# Altium schematic sheet fpga_core.SchDoc
size A4
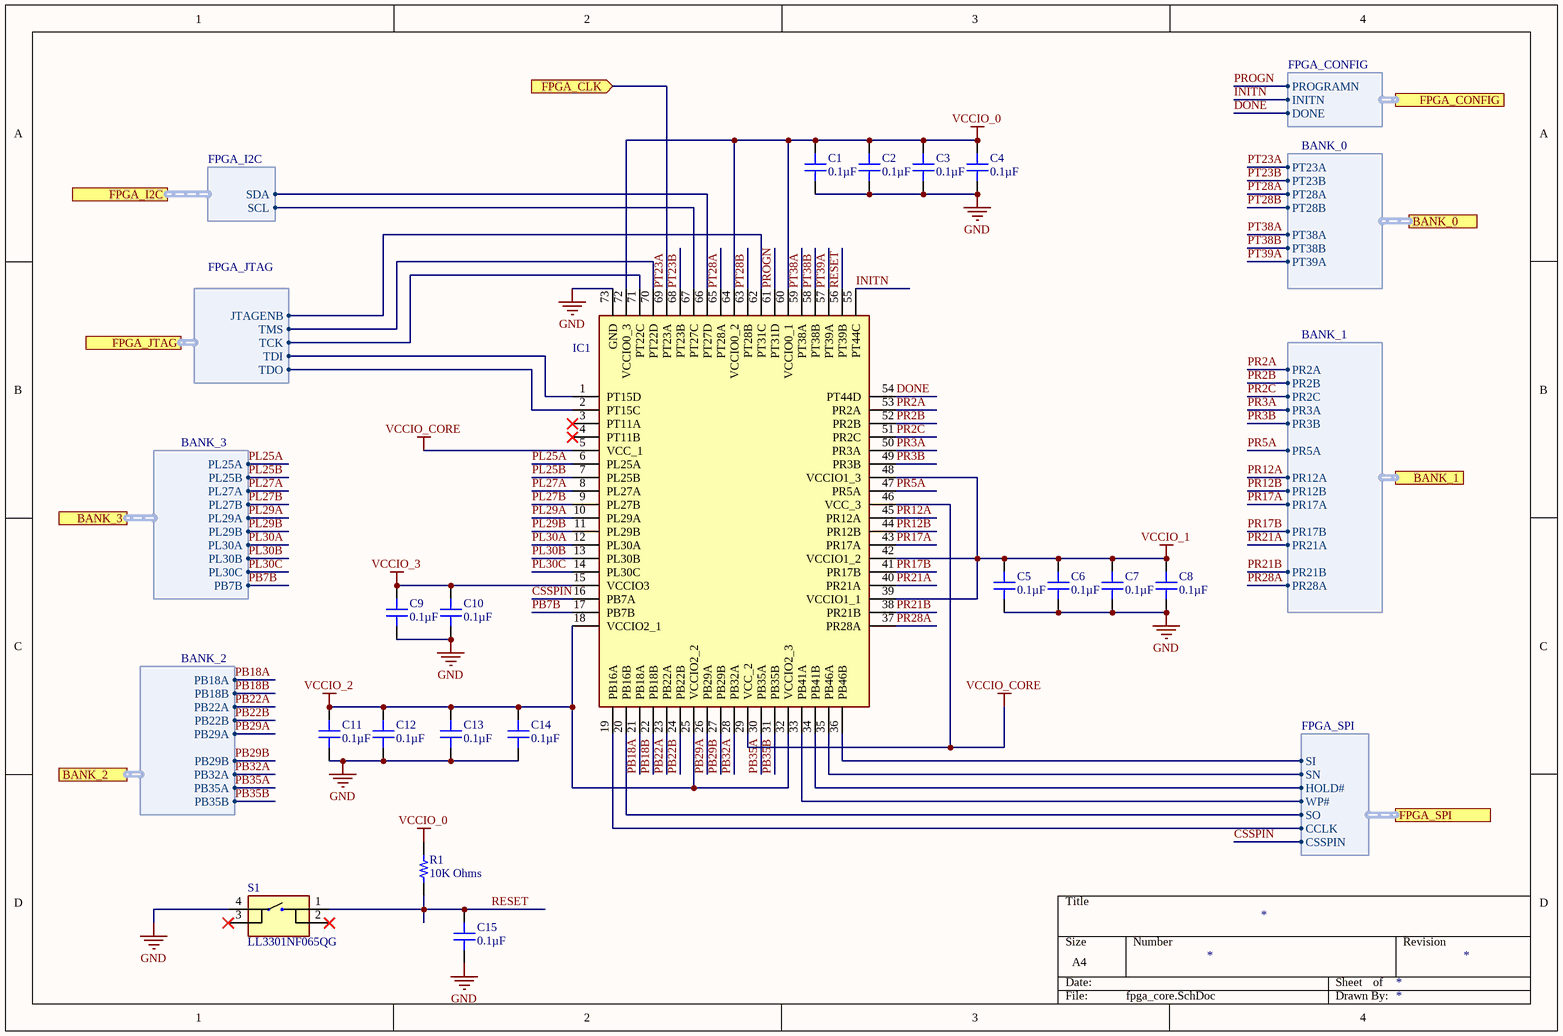
[diagram p0: fpga_core.SchDoc]

## Parts
C1  0.1µF  [CAP 0603_1608]
C2  0.1µF  [CAP 0603_1608]
C3  0.1µF  [CAP 0603_1608]
C4  0.1µF  [CAP 0603_1608]
C5  0.1µF  [CAP 0603_1608]
C6  0.1µF  [CAP 0603_1608]
C7  0.1µF  [CAP 0603_1608]
C8  0.1µF  [CAP 0603_1608]
C9  0.1µF  [CAP 0603_1608]
C10  0.1µF  [CAP 0603_1608]
C11  0.1µF  [CAP 0603_1608]
C12  0.1µF  [CAP 0603_1608]
C13  0.1µF  [CAP 0603_1608]
C14  0.1µF  [CAP 0603_1608]
C15  0.1µF  [CAP 0603_1608]
IC1  LCMXO3D-9400HC-6SG72C  [QFN50P1000X1000X90-73N-D]  (value not drawn)
R1  10K Ohms  [RES 0603_1608]
S1  LL3301NF065QG  [LL3301NF065QG]

## Ports
BANK_0 (harness BANK_0), BANK_1 (harness BANK_1), BANK_2 (harness BANK_2), BANK_3 (harness BANK_3), FPGA_CLK (in), FPGA_CONFIG (harness FPGA_CONFIG), FPGA_I2C (harness FPGA_I2C), FPGA_JTAG (harness FPGA_JTAG), FPGA_SPI (harness FPGA_SPI)

## Harnesses
BANK_3: PB7B, PL30C, PL30B, PL30A, PL29B, PL29A, PL27B, PL27A, PL25B, PL25A
BANK_1: PR2A, PR2B, PR2C, PR3A, PR3B, PR5A, PR12A, PR12B, PR17A, PR17B, PR21A, PR21B, PR28A
BANK_0: PT23A, PT23B, PT28A, PT28B, PT38A, PT38B, PT39A
BANK_2: PB35B, PB35A, PB32A, PB29B, PB29A, PB22B, PB22A, PB18B, PB18A
FPGA_SPI: SI, SN, SO, CCLK, CSSPIN, HOLD#, WP#
FPGA_I2C: SDA, SCL
FPGA_JTAG: JTAGENB, TMS, TCK, TDI, TDO
FPGA_CONFIG: PROGRAMN, INITN, DONE

## Nets
GND: C1.1 C2.1 C3.1 C4.1 C5.1 C6.1 C7.1 C8.1 C9.1 C10.1 C11.1 C12.1 C13.1 C14.1 C15.1 IC1.73(GND) S1.4
VCCIO_0: C1.2 C2.2 C3.2 C4.2 IC1.60(VCCIO0_1) IC1.64(VCCIO0_2) IC1.72(VCCIO0_3) R1.2
VCCIO_1: C5.2 C6.2 C7.2 C8.2 IC1.39(VCCIO1_1) IC1.42(VCCIO1_2) IC1.48(VCCIO1_3)
VCCIO_2: C11.2 C12.2 C13.2 C14.2 IC1.18(VCCIO2_1) IC1.25(VCCIO2_2) IC1.32(VCCIO2_3)
VCCIO_3: C9.2 C10.2 IC1.15(VCCIO3)
VCCIO_CORE: IC1.5(VCC_1) IC1.29(VCC_2) IC1.46(VCC_3)
CSSPIN: IC1.16(PB7A) ; port FPGA_SPI.CSSPIN
DONE: IC1.54(PT44D) ; port FPGA_CONFIG.DONE
INITN: IC1.55(PT44C) ; port FPGA_CONFIG.INITN
PB7B: IC1.17(PB7B) ; port BANK_3.PB7B
PB18A: IC1.21(PB18A) ; port BANK_2.PB18A
PB18B: IC1.22(PB18B) ; port BANK_2.PB18B
PB22A: IC1.23(PB22A) ; port BANK_2.PB22A
PB22B: IC1.24(PB22B) ; port BANK_2.PB22B
PB29A: IC1.26(PB29A) ; port BANK_2.PB29A
PB29B: IC1.27(PB29B) ; port BANK_2.PB29B
PB32A: IC1.28(PB32A) ; port BANK_2.PB32A
PB35A: IC1.30(PB35A) ; port BANK_2.PB35A
PB35B: IC1.31(PB35B) ; port BANK_2.PB35B
PL25A: IC1.6(PL25A) ; port BANK_3.PL25A
PL25B: IC1.7(PL25B) ; port BANK_3.PL25B
PL27A: IC1.8(PL27A) ; port BANK_3.PL27A
PL27B: IC1.9(PL27B) ; port BANK_3.PL27B
PL29A: IC1.10(PL29A) ; port BANK_3.PL29A
PL29B: IC1.11(PL29B) ; port BANK_3.PL29B
PL30A: IC1.12(PL30A) ; port BANK_3.PL30A
PL30B: IC1.13(PL30B) ; port BANK_3.PL30B
PL30C: IC1.14(PL30C) ; port BANK_3.PL30C
PR2A: IC1.53(PR2A) ; port BANK_1.PR2A
PR2B: IC1.52(PR2B) ; port BANK_1.PR2B
PR2C: IC1.51(PR2C) ; port BANK_1.PR2C
PR3A: IC1.50(PR3A) ; port BANK_1.PR3A
PR3B: IC1.49(PR3B) ; port BANK_1.PR3B
PR5A: IC1.47(PR5A) ; port BANK_1.PR5A
PR12A: IC1.45(PR12A) ; port BANK_1.PR12A
PR12B: IC1.44(PR12B) ; port BANK_1.PR12B
PR17A: IC1.43(PR17A) ; port BANK_1.PR17A
PR17B: IC1.41(PR17B) ; port BANK_1.PR17B
PR21A: IC1.40(PR21A) ; port BANK_1.PR21A
PR21B: IC1.38(PR21B) ; port BANK_1.PR21B
PR28A: IC1.37(PR28A) ; port BANK_1.PR28A
PROGN: IC1.61(PT31D) ; port FPGA_CONFIG.PROGRAMN
PT23A: IC1.69(PT23A) ; port FPGA_CLK, port BANK_0.PT23A
PT23B: IC1.68(PT23B) ; port BANK_0.PT23B
PT28A: IC1.65(PT28A) ; port BANK_0.PT28A
PT28B: IC1.63(PT28B) ; port BANK_0.PT28B
PT38A: IC1.59(PT38A) ; port BANK_0.PT38A
PT38B: IC1.58(PT38B) ; port BANK_0.PT38B
PT39A: IC1.57(PT39A) ; port BANK_0.PT39A
RESET: C15.2 IC1.56(PT39B) R1.1 S1.1
NetIC1_1: IC1.1(PT15D) ; port FPGA_JTAG.TDI
NetIC1_2: IC1.2(PT15C) ; port FPGA_JTAG.TDO
NetIC1_19: IC1.19(PB16A) ; port FPGA_SPI.CCLK
NetIC1_20: IC1.20(PB16B) ; port FPGA_SPI.SO
NetIC1_33: IC1.33(PB41A) ; port FPGA_SPI.WP#
NetIC1_34: IC1.34(PB41B) ; port FPGA_SPI.HOLD#
NetIC1_35: IC1.35(PB46A) ; port FPGA_SPI.SN
NetIC1_36: IC1.36(PB46B) ; port FPGA_SPI.SI
NetIC1_62: IC1.62(PT31C) ; port FPGA_JTAG.JTAGENB
NetIC1_66: IC1.66(PT27D) ; port FPGA_I2C.SDA
NetIC1_67: IC1.67(PT27C) ; port FPGA_I2C.SCL
NetIC1_70: IC1.70(PT22D) ; port FPGA_JTAG.TMS
NetIC1_71: IC1.71(PT22C) ; port FPGA_JTAG.TCK

Not connected (* = marked no-connect by the designer): IC1 3(PT11A)* 4(PT11B)*; S1 2* 3*

## Library data of the parts
C1-C15 = CS0603KRX7R7BB104: CAP CER 0.1UF 16V X7R 0603; Manufacturer: Yageo; Tolerance: ±10%; Part Number: CS0603KRX7R7BB104; Value: 0.1µF; Applications: Boardflex Sensitive; Capacitance: 0.1µF; ComponentLink1Description: Datasheet; ComponentLink1URL: http://www.yageo.com/NewPortal/yageodocoutput?fileName=/pdf/MLCC/UPY-ST_NPOX7R_16V-to-3KV_5.pdf; ComponentLink2Description: DigiKey Link; ComponentLink2URL: http://digikey.com/product-detail/en/yageo/CS0603KRX7R7BB104/311-3560-1-ND/7648487; Device Package: 0603 (1608 Metric); Features: Soft Termination; LastUpdated: 02.09.2020 1:03:36; Lifecycle Status: Active; Minimum Order: 1; Mounting Type: Surface Mount, MLCC; Operating Temperature: -55°C ~ 125°C; Package / Case: 0603 (1608 Metric); Packaging: TapeAndReel; PartId: 2286; Part Status: Active; Price: 0.02; Series: CS; Size / Dimension: 0.063" L x 0.031" W (1.60mm x 0.80mm); Supplier 1: DigiKey; Supplier Part Number 1: 311-3560-1-ND; Temperature Coefficient: X7R; Thickness (Max): 0.037" (0.95mm); Voltage - Rated: 16V
IC1 = LCMXO3D-9400HC-6SG72C: Integrated Circuit; Manufacturer_Name: Lattice Semiconductor; Datasheet Link: http://www.latticesemi.com/Products/FPGAandCPLD/MachXO3D; Height: 0.9mm; Manufacturer_Part_Number: LCMXO3D-9400HC-6SG72C; Mouser Part Number: 842-O3D9400HC6SG72C; Mouser Price/Stock: https://www.mouser.co.uk/ProductDetail/Lattice/LCMXO3D-9400HC-6SG72C?qs=P1JMDcb91o5zlo%2FfseWNjQ%3D%3D
R1 = CRCW0603470RJNEAHP: RES SMD 470 OHM 5% 1/4W 0603; Manufacturer: Vishay Dale; Power (Watts): 0.25W, 1/4W; Resistance: 470 Ohms; Temperature Coefficient: ±200ppm/°C; Part Number: CRCW0603470RJNEAHP; Value: 10K Ohms; ComponentLink1Description: Datasheet; ComponentLink1URL: http://www.vishay.com/docs/20043/crcwhpe3.pdf; ComponentLink2Description: DigiKey Link; ComponentLink2URL: http://digikey.com/product-detail/en/vishay-dale/CRCW0603470RJNEAHP/541-470SACT-ND/2222809; Composition: Thick Film; Device Package: 0603 (1608 Metric); Features: Automotive AEC-Q200, Pulse Withstanding; Height - Seated (Max): 0.022" (0.55mm); LastUpdated: 02.09.2020 1:09:49; Lifecycle Status: Active; Minimum Order: 1; Number of Terminations: 2; Operating Temperature: -55°C ~ 155°C; Package / Case: 0603 (1608 Metric); Packaging: TapeAndReel; PartId: 21320; Part Status: Active; Price: 0.02; Ratings: AEC-Q200; Series: CRCW-HP; Size / Dimension: 0.063" L x 0.033" W (1.60mm x 0.85mm); Supplier Device Package: 0603; Tolerance: ±5%; Supplier 1: Farnell; Supplier Part Number 1: 3495224
S1 = LL3301NF065QG: Switch; Manufacturer_Name: E-Switch; Datasheet Link: http://spec_sheets.e-switch.com/specs/P090002.pdf; Height: 4mm; Manufacturer_Part_Number: LL3301NF065QG; Mouser Part Number: 612-LL3301NF065QG; Mouser Price/Stock: https://www.mouser.co.uk/ProductDetail/E-Switch/LL3301NF065QG/?qs=QtyuwXswaQiWhwgY68YTTw%3D%3D